# Altium schematic sheet SysACE_SysFLASH.SchDoc: FPGA Motherboard for Digital Multiplexed Readout, McGill U.
size B; DocumentNumber: DfMUX10; Revision: Rev0, Prototype; SheetNumber: 10; SheetTotal: 27; PageSetup: Record=PageOptions|CenterHorizontal=True|CenterVertical=True|PrintScale=1.08|XCorrection=1.00|YCorrection=1.00|PrintKind=0|BorderSize=5000000|LeftOffset=0|BottomOffset=0|Orientation=2|PaperLength=1000|PaperWidth=1000|Scale=100|PaperSource=7|PrintQuality=-4|MediaType=1|DitherType=10|PaperKind=Tabloid|PrintScaleMode=1
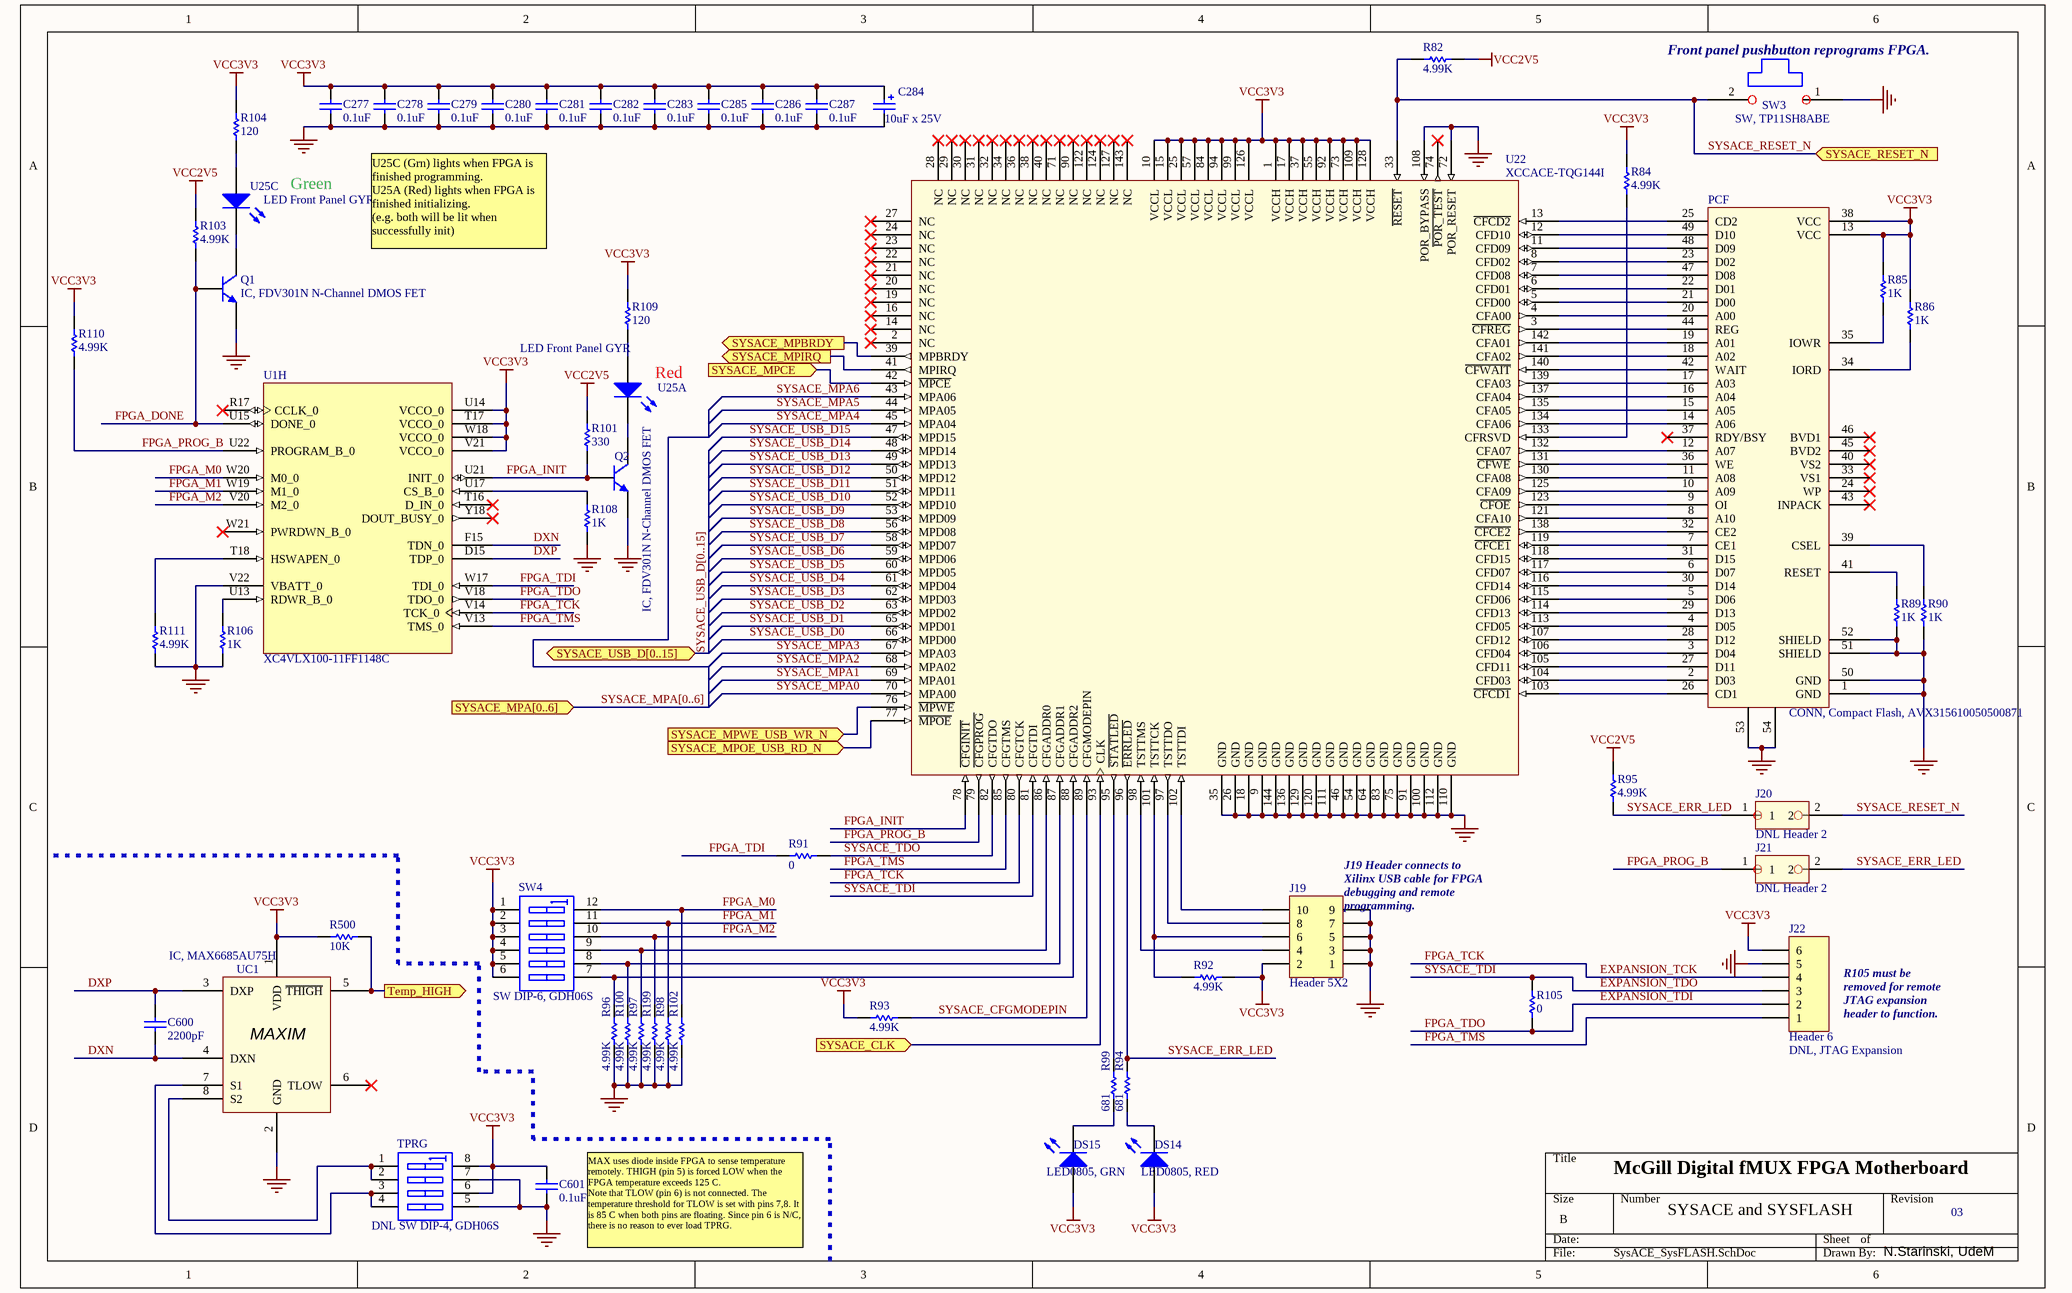
[diagram p0: SysACE_SysFLASH.SchDoc]

## Parts
C277  0.1uF  [CC1608-0603]
C278  0.1uF  [CC1608-0603]
C279  0.1uF  [CC1608-0603]
C280  0.1uF  [CC1608-0603]
C281  0.1uF  [CC1608-0603]
C282  0.1uF  [CC1608-0603]
C283  0.1uF  [CC1608-0603]
C284  10uF x 25V  [TC6032-2412]
C285  0.1uF  [CC1608-0603]
C286  0.1uF  [CC1608-0603]
C287  0.1uF  [CC1608-0603]
C600  2200pF  [CC1608-0603]
C601  0.1uF  [CC1608-0603]
DS14  LED0805, RED  [SMD _LED]
DS15  LED0805, GRN  [SMD _LED]
J19  Header 5X2  [HDR2X5]
J20  DNL Header 2  [HDR1X2]
J21  DNL Header 2  [HDR1X2]
J22  Header 6  Assembly: DNL, JTAG Expansion  [HDR1X6]
PCF  CONN, Compact Flash, AVX315610050500871  [CF_AVX5611]
Q1  IC, FDV301N N-Channel DMOS FET  [SOT23]
Q2  IC, FDV301N N-Channel DMOS FET  [SOT23]
R82  4.99K  [CR1608-0603]
R84  4.99K  [CR1608-0603]
R85  1K  [CR1608-0603]
R86  1K  [CR1608-0603]
R89  1K  [CR1608-0603]
R90  1K  [CR1608-0603]
R91  0  [CR1608-0603]
R92  4.99K  [CR1608-0603]
R93  4.99K  [CR1608-0603]
R94  681  [CR1608-0603]
R95  4.99K  [CR1608-0603]
R96  4.99K  [CR1608-0603]
R97  4.99K  [CR1608-0603]
R98  4.99K  [CR1608-0603]
R99  681  [CR1608-0603]
R100  4.99K  [CR1608-0603]
R101  330  [CR1608-0603]
R102  4.99K  [CR1608-0603]
R103  4.99K  [CR1608-0603]
R104  120  [CR1608-0603]
R105  0  [CR1608-0603]
R106  1K  [CR1608-0603]
R108  1K  [CR1608-0603]
R109  120  [CR1608-0603]
R110  4.99K  [CR1608-0603]
R111  4.99K  [CR1608-0603]
R199  4.99K  [CR1608-0603]
R500  10K  [CR1608-0603]
SW3  SW, TP11SH8ABE  [TP11SH8ABE]
SW4  SW DIP-6, GDH06S  [DIP_SW_SM6POS]
TPRG  DNL SW DIP-4, GDH06S  [SO-G8]
U1  XC4VLX100-11FF1148C  [FF1148]  (part H of 10)
U22  XCCACE-TQG144I  [TQFP144]
U25  LED Front Panel GYR  [LED_Tri_]  (parts A,C of 3)
UC1  IC, MAX6685AU75H  [uSOP8]

## Ports
SYSACE_CLK (in), SYSACE_MPA[0..6] (in), SYSACE_MPBRDY (out), SYSACE_MPCE (in), SYSACE_MPIRQ (out), SYSACE_MPOE_USB_RD_N (in), SYSACE_MPWE_USB_WR_N (in), SYSACE_RESET_N (in), SYSACE_USB_D[0..15], Temp_HIGH (out)

## Nets
GND: C277.1 C278.1 C279.1 C280.1 C281.1 C282.1 C283.1 C284.2 C285.1 C286.1 C287.1 C601.1 J19.1 J19.3 J19.5 J19.7 J19.9 J22.5 PCF.1(GND) PCF.50(GND) PCF.51(SHIELD) PCF.52(SHIELD) PCF.53(GND) PCF.54(GND) Q1.2(E) Q2.2(E) R89.1 R90.1 R96.1 R97.1 R98.1 R100.1 R102.1 R106.1 R108.1 R111.1 R199.1 SW3.1 TPRG.5(B4) TPRG.7(B2) U1.V22(VBATT_0) U22.9(GND) U22.18(GND) U22.26(GND) U22.35(GND) U22.46(GND) U22.54(GND) U22.64(GND) U22.72(POR_RESET) U22.75(GND) U22.83(GND) U22.91(GND) U22.100(GND) U22.108(POR_BYPASS) U22.110(GND) U22.111(GND) U22.112(GND) U22.120(GND) U22.129(GND) U22.136(GND) U22.144(GND) UC1.2(GND)
VCC2V5: R82.2 R95.2 R101.2 R103.2
VCC3V3: C277.2 C278.2 C279.2 C280.2 C281.2 C282.2 C283.2 C284.1 C285.2 C286.2 C287.2 C601.2 DS14.1(A) DS15.1(A) J19.2 J22.6 PCF.13(VCC) PCF.38(VCC) R84.2 R85.2 R86.2 R92.2 R93.1 R104.2 R109.2 R110.2 R500.1 SW4.1(A1) SW4.2(A2) SW4.3(A3) SW4.4(A4) SW4.5(A5) SW4.6(A6) TPRG.6(B3) TPRG.8(B1) U1.T17(VCCO_0) U1.U14(VCCO_0) U1.V21(VCCO_0) U1.W18(VCCO_0) U22.1(VCCH) U22.10(VCCL) U22.15(VCCL) U22.17(VCCH) U22.25(VCCL) U22.37(VCCH) U22.55(VCCH) U22.57(VCCL) U22.73(VCCH) U22.84(VCCL) U22.92(VCCH) U22.94(VCCL) U22.99(VCCL) U22.109(VCCH) U22.126(VCCL) U22.128(VCCH) UC1.1(VDD)
DXN: C600.1 U1.F15(TDN_0) UC1.4(DXN)
DXP: C600.2 U1.D15(TDP_0) UC1.3(DXP)
EXPANSION_TCK: J22.4 U1.V14(TCK_0) U22.80(CFGTCK)  [also labelled FPGA_TCK]
EXPANSION_TDI: J22.2 R105.1 U1.V18(TDO_0)  [also labelled FPGA_TDO]
EXPANSION_TDO: J22.3 R105.2 U22.81(CFGTDI)  [also labelled SYSACE_TDI]
FPGA_DONE: Q1.1(B) R103.1 U1.U15(DONE_0)
FPGA_INIT: Q2.1(B) R101.1 U1.U21(INIT_0) U22.78(~{CFGINIT})
FPGA_M0: R102.2 SW4.12(B1) U1.W20(M0_0)
FPGA_M1: R98.2 SW4.11(B2) U1.W19(M1_0)
FPGA_M2: R199.2 SW4.10(B3) U1.V20(M2_0)
FPGA_PROG_B: J21.1 R110.1 U1.U22(PROGRAM_B_0) U22.79(~{CFGPROG})
FPGA_TDI: R91.1 U1.W17(TDI_0)
FPGA_TMS: J22.1 U1.V13(TMS_0) U22.85(CFGTMS)
SYSACE_CFGMODEPIN: R93.2 U22.89(CFGMODEPIN)
SYSACE_CLK: U22.93(CLK) ; port SYSACE_CLK
SYSACE_ERR_LED: J20.1 J21.2 R94.2 R95.1 U22.96(~{ERRLED})
SYSACE_MPA0: U22.70(MPA00)
SYSACE_MPA1: U22.69(MPA01)
SYSACE_MPA2: U22.68(MPA02)
SYSACE_MPA3: U22.67(MPA03)
SYSACE_MPA4: U22.45(MPA04)
SYSACE_MPA5: U22.44(MPA05)
SYSACE_MPA6: U22.43(MPA06)
SYSACE_MPBRDY: U22.39(MPBRDY) ; port SYSACE_MPBRDY
SYSACE_MPCE: U22.42(~{MPCE}) ; port SYSACE_MPCE
SYSACE_MPIRQ: U22.41(MPIRQ) ; port SYSACE_MPIRQ
SYSACE_MPOE_USB_RD_N: U22.77(~{MPOE}) ; port SYSACE_MPOE_USB_RD_N
SYSACE_MPWE_USB_WR_N: U22.76(~{MPWE}) ; port SYSACE_MPWE_USB_WR_N
SYSACE_RESET_N: J20.2 R82.1 SW3.2 U22.33(~{RESET}) ; port SYSACE_RESET_N
SYSACE_TDO: R91.2 U22.82(CFGTDO)
SYSACE_USB_D0: U22.66(MPD00)
SYSACE_USB_D1: U22.65(MPD01)
SYSACE_USB_D2: U22.63(MPD02)
SYSACE_USB_D3: U22.62(MPD03)
SYSACE_USB_D4: U22.61(MPD04)
SYSACE_USB_D5: U22.60(MPD05)
SYSACE_USB_D6: U22.59(MPD06)
SYSACE_USB_D7: U22.58(MPD07)
SYSACE_USB_D8: U22.56(MPD08)
SYSACE_USB_D9: U22.53(MPD09)
SYSACE_USB_D10: U22.52(MPD10)
SYSACE_USB_D11: U22.51(MPD11)
SYSACE_USB_D12: U22.50(MPD12)
SYSACE_USB_D13: U22.49(MPD13)
SYSACE_USB_D14: U22.48(MPD14)
SYSACE_USB_D15: U22.47(MPD15)
Temp_HIGH: R500.2 UC1.5(~{THIGH}) ; port Temp_HIGH
NetDS14_2: DS14.2(K) R94.1
NetDS15_2: DS15.2(K) R99.1
NetJ19_4: J19.4 U22.98(TSTTMS)
NetJ19_6: J19.6 R92.1 U22.101(TSTTCK)
NetJ19_8: J19.8 U22.97(TSTTDO)
NetJ19_10: J19.10 U22.102(TSTTDI)
NetPCF_2: PCF.2(D03) U22.104(CFD03)
NetPCF_3: PCF.3(D04) U22.106(CFD04)
NetPCF_4: PCF.4(D05) U22.113(CFD05)
NetPCF_5: PCF.5(D06) U22.115(CFD06)
NetPCF_6: PCF.6(D07) U22.117(CFD07)
NetPCF_7: PCF.7(CE1) U22.119(~{CFCE1})
NetPCF_8: PCF.8(A10) U22.121(CFA10)
NetPCF_9: PCF.9(OI) U22.123(~{CFOE})
NetPCF_10: PCF.10(A09) U22.125(CFA09)
NetPCF_11: PCF.11(A08) U22.130(CFA08)
NetPCF_12: PCF.12(A07) U22.132(CFA07)
NetPCF_14: PCF.14(A06) U22.134(CFA06)
NetPCF_15: PCF.15(A05) U22.135(CFA05)
NetPCF_16: PCF.16(A04) U22.137(CFA04)
NetPCF_17: PCF.17(A03) U22.139(CFA03)
NetPCF_18: PCF.18(A02) U22.141(CFA02)
NetPCF_19: PCF.19(A01) U22.142(CFA01)
NetPCF_20: PCF.20(A00) U22.4(CFA00)
NetPCF_21: PCF.21(D00) U22.5(CFD00)
NetPCF_22: PCF.22(D01) U22.6(CFD01)
NetPCF_23: PCF.23(D02) U22.8(CFD02)
NetPCF_25: PCF.25(CD2) U22.13(~{CFCD2})
NetPCF_26: PCF.26(CD1) U22.103(~{CFCD1})
NetPCF_27: PCF.27(D11) U22.105(CFD11)
NetPCF_28: PCF.28(D12) U22.107(CFD12)
NetPCF_29: PCF.29(D13) U22.114(CFD13)
NetPCF_30: PCF.30(D14) U22.116(CFD14)
NetPCF_31: PCF.31(D15) U22.118(CFD15)
NetPCF_32: PCF.32(CE2) U22.138(~{CFCE2})
NetPCF_34: PCF.34(IORD) R86.1
NetPCF_35: PCF.35(IOWR) R85.1
NetPCF_36: PCF.36(WE) U22.131(~{CFWE})
NetPCF_39: PCF.39(CSEL) R90.2
NetPCF_41: PCF.41(RESET) R89.2
NetPCF_42: PCF.42(WAIT) U22.140(~{CFWAIT})
NetPCF_44: PCF.44(REG) U22.3(~{CFREG})
NetPCF_47: PCF.47(D08) U22.7(CFD08)
NetPCF_48: PCF.48(D09) U22.11(CFD09)
NetPCF_49: PCF.49(D10) U22.12(CFD10)
NetQ1_3: Q1.3(C) U25.K3(K)
NetQ2_3: Q2.3(C) U25.K1(K)
NetR84_1: R84.1 U22.133(CFRSVD)
NetR96_2: R96.2 SW4.7(B6) U22.88(CFGADDR2)
NetR97_2: R97.2 SW4.9(B4) U22.86(CFGADDR0)
NetR99_2: R99.2 U22.95(~{STATLED})
NetR100_2: R100.2 SW4.8(B5) U22.87(CFGADDR1)
NetR104_1: R104.1 U25.A3(A)
NetR106_2: R106.2 U1.U13(RDWR_B_0)
NetR108_2: R108.2 U1.U17(CS_B_0)
NetR109_1: R109.1 U25.A1(A)
NetR111_2: R111.2 U1.T18(HSWAPEN_0)
NetTPRG_1: TPRG.1(A1) TPRG.2(A2) UC1.8(S2)
NetTPRG_3: TPRG.3(A3) TPRG.4(A4) UC1.7(S1)

Not connected (* = marked no-connect by the designer): PCF 24(WP)* 33(VS1)* 37(RDY/BSY)* 40(VS2)* 43(INPACK)* 45(BVD2)* 46(BVD1)*; U1 R17(CCLK_0)* T16(D_IN_0)* W21(PWRDWN_B_0)* Y18(DOUT_BUSY_0)*; U22 2(NC)* 14(NC)* 16(NC)* 19(NC)* 20(NC)* 21(NC)* 22(NC)* 23(NC)* 24(NC)* 27(NC)* 28(NC)* 29(NC)* 30(NC)* 31(NC)* 32(NC)* 34(NC)* 36(NC)* 38(NC)* 40(NC)* 71(NC)* 74(~{POR_TEST})* 90(NC)* 122(NC)* 124(NC)* 127(NC)* 143(NC)*; UC1 6(TLOW)*

## Buses and harness runs
bus SYSACE_MPA[0..6] = port SYSACE_MPA[0..6]
bus SYSACE_USB_D[0..15] = port SYSACE_USB_D[0..15]

## Notes on the sheet
- (near SW3) Front panel pushbutton reprograms FPGA.
- Green
- U25C (Grn) lights when FPGA is finished programming.
  U25A (Red) lights when FPGA is finished initializing.
  (e.g. both will be lit when successfully init)
- Red
- Text
- (near J19) J19 Header connects to Xilinx USB cable for FPGA debugging and remote programming.
- R105 must be removed for remote JTAG expansion header to function.
- McGill Digital fMUX FPGA Motherboard
- (near C601) MAX uses diode inside FPGA to sense temperature remotely. THIGH (pin 5) is forced LOW when the FPGA temperature exceeds 125 C.
  Note that TLOW (pin 6) is not connected. The temperature threshold for TLOW is set with pins 7,8. It is 85 C when both pins are floating. Since pin 6 is N/C, there is no reason to ever load TPRG.
- SYSACE and SYSFLASH
- 03
- N.Starinski, UdeM
- (in symbol MAX6685) MAXIM

## Library data of the parts
C277-C283 C285-C287 C600 C601 = Cap Semi: Capacitor (Semiconductor SIM Model); Published: 8-Jun-2000; LatestRevisionDate: 17-Jul-2002; LatestRevisionNote: Re-released for DXP Platform.; PackageReference: C1206; Publisher: Altium Limited
C284 = Cap Pol3: CAP POL B45197A5106K309; Published: 8-Jun-2000; LatestRevisionDate: 17-Jul-2002; LatestRevisionNote: Re-released for DXP Platform.; PackageReference: C0805; Publisher: Altium Limited
DS14 = LED3: LED 0805 LTST-C170CKT; Published: 8-Jun-2000; LatestRevisionDate: 17-Dec-2003; LatestRevisionNote: PCB Footprint replaced.; Publisher: Altium Limited
DS15 = LED3: LED 0805 LTST-C170GKT; Published: 8-Jun-2000; LatestRevisionDate: 17-Dec-2003; LatestRevisionNote: PCB Footprint replaced.; Publisher: Altium Limited
J19 = Header 5X2: Header, 0.1" 5-Pin, Dual row straight; LatestRevisionDate: 17-Jul-2002; LatestRevisionNote: Re-released for DXP Platform.; Publisher: Altium Limited
J20 J21 = Jumper_100mil: Header, 0.1" 2-Pin straight; Assembly: DNL
J22 = Header 6: Header, 0.1" 6-Pin straight; LatestRevisionDate: 17-Jul-2002; LatestRevisionNote: Re-released for DXP Platform.; Publisher: Altium Limited
PCF = CF_Conn: Compact Flash Connector
Q1 Q2 = MMBT3904: NPN Switching Transistor; Published: 17-Sep-2003; DatasheetDocument: 13-May-2002; PackageDocument: May-1999; PackageReference: SOT23; Publisher: Altium Limited; ComponentLink1Description: Manufacturer Link; ComponentLink1URL: http://www.semiconductors.philips.com/; ComponentLink2Description: Datasheet; ComponentLink2URL: http://www.semiconductors.philips.com/acrobat/datasheets/MMBT3904_4.pdf
R82 R84-R86 R89-R106 R108-R111 R199 R500 = Res Semi: Resistor 0603; Published: 8-Jun-2000; LatestRevisionDate: 17-Jul-2002; LatestRevisionNote: Re-released for DXP Platform.; Publisher: Altium Limited
SW3 = Tiny Pushbutton Switch: Right angle PC trough
SW4 = SW DIP-6: DIP Switch, 6 Position, SPST; Published: 24-Mar-1999; LatestRevisionDate: 17-Jul-2002; LatestRevisionNote: Re-released for DXP Platform.; Publisher: Altium Limited
TPRG = SW DIP-4: DIP Switch, 4 Position, SPST; Published: 24-Mar-1999; LatestRevisionDate: 17-Jul-2002; LatestRevisionNote: Re-released for DXP Platform.; Publisher: Altium Limited; Code_JEDEC: MS-012-AA; Code_IPC: SO8
U1 = XC4VLX100-11FF1148C: Xilinx Virtex-4 LX Platform FPGA, 1148-Ball FFBGA, Speed Grade 11, 768 User I/Os, Commercial Grade; PackageDocument: ver1.0, Oct-2002; Published: 13-Dec-2004; LatestRevisionDate: 4-Mar-2005; LatestRevisionNote: D_IN & CS_B pins changed from I/O to Input. DOUT_BUSY pin changed from I/O to Output.; DatasheetDocument: ver1.2, Dec-2004; PackageReference: FF1148; Publisher: Altium Limited; ComponentLink2Description: Virtex-4 Overview; ComponentLink2URL: http://www.xilinx.com/products/virtex4/overview.htm; ComponentLink3Description: Datasheet; ComponentLink3URL: http://direct.xilinx.com/bvdocs/userguides/ug075.pdf; Code_JEDEC: MS-034-AAR-1
U22 = XCCACE-TQG144I: System ACE CF Xilinx
U25 = LED_Tri: 564-0200-132F
UC1 = MAX6685: Dual-Output Remote-Junction Temperature Switch